# EAGLE design launchpad (EAGLE 6.3)
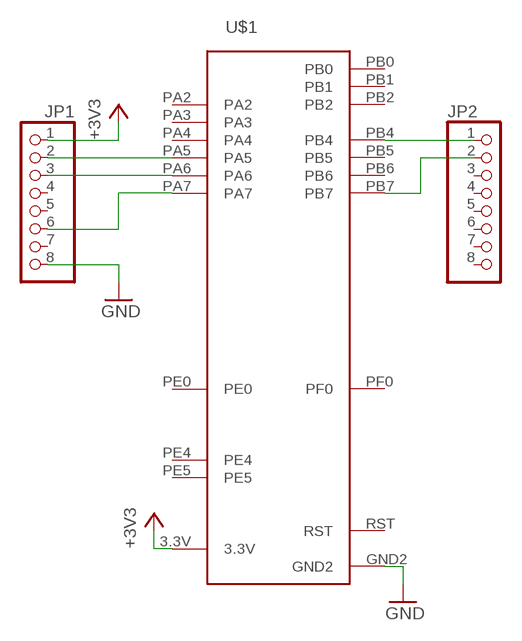
[diagram p0: schematic, sheet 1]

## Parts
JP1  PINHD-1X8  [1X08]
JP2  PINHD-1X8  [1X08]
U$1  STELLARIS-LAUNCHPAD-COMPATIBLESTELLARIS-LAUNCHPAD-COMPATIBLE  [LAUNCHPAD-COMPATIBLE]

## Nets
+3V3: JP1.1 U$1.3.3V
GND: JP1.8 U$1.GND2
N$1: JP2.2 U$1.PB7
N$2: JP2.1 U$1.PB4
N$3: JP1.2 U$1.PA5
N$4: JP1.3 U$1.PA6
N$5: JP1.6 U$1.PA7
Unconnected: JP1.4 JP1.5 JP1.7 JP2.3 JP2.4 JP2.5 JP2.6 JP2.7 JP2.8 U$1.PA2 U$1.PA3 U$1.PA4 U$1.PB0 U$1.PB1 U$1.PB2 U$1.PB5 U$1.PB6 U$1.PE0 U$1.PE4 U$1.PE5 U$1.PF0

## Power pins joined to a net without a drawn wire
RST: U$1.RST

## Library data of the parts
JP1 JP2 = pinhead:PINHD-1X8: PIN HEADER
U$1 = StellarisLaunchPad_Fred:STELLARIS-LAUNCHPAD-COMPATIBLE

## Board
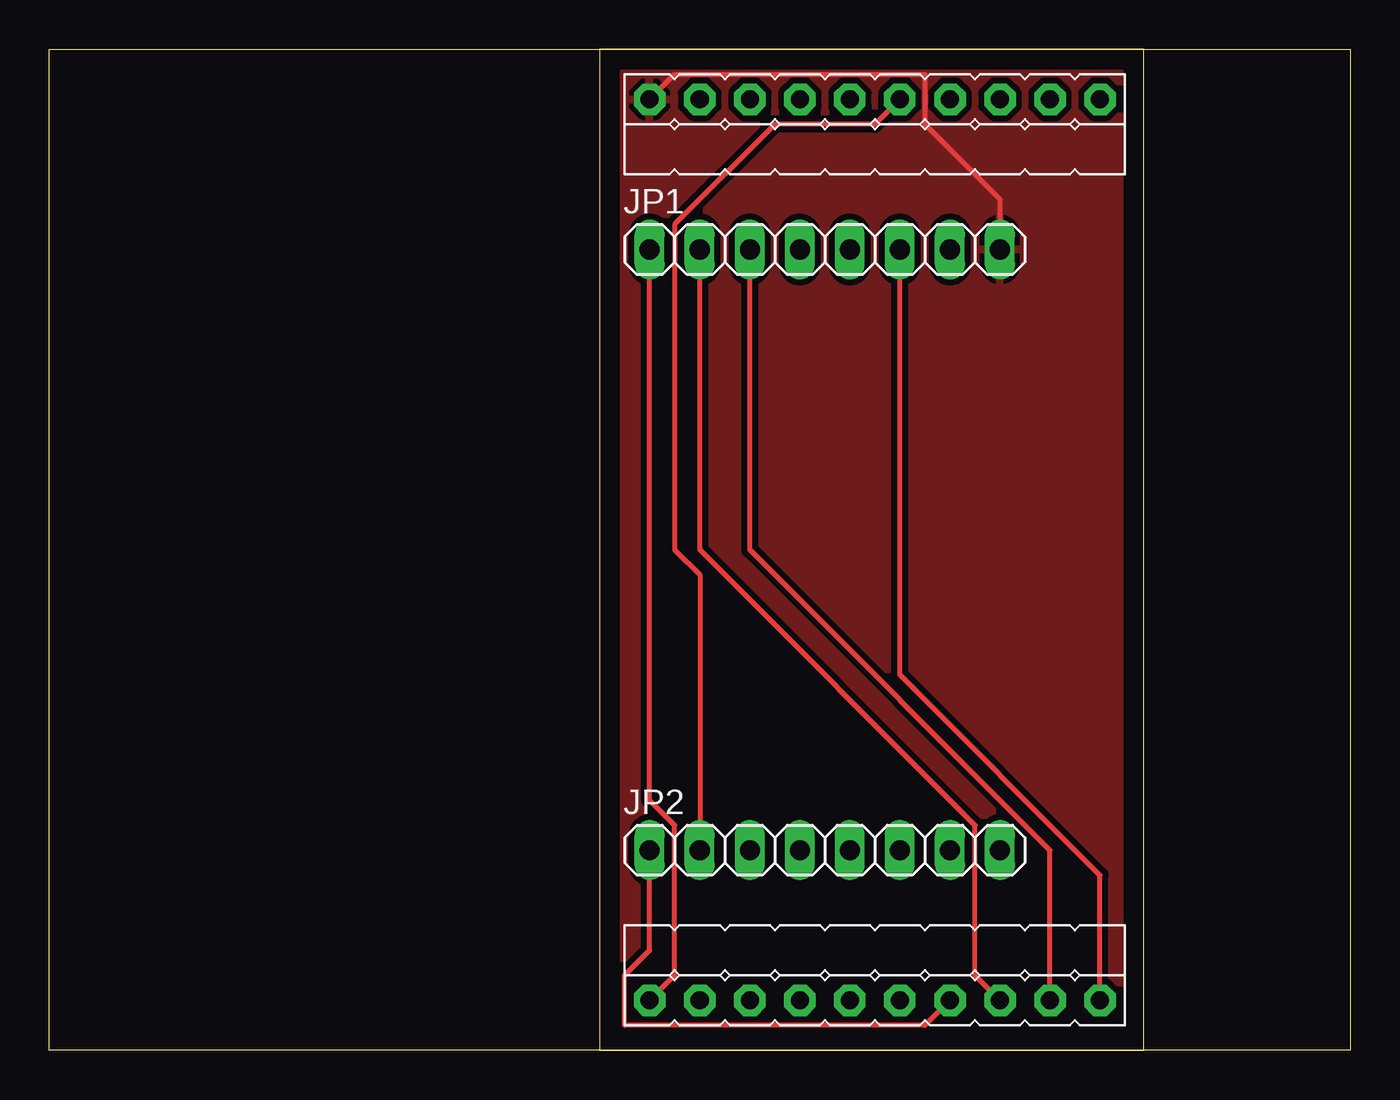
[diagram p1: board, top side]

Size 27.61 x 50.79 mm. Coordinates in mm from the lower left corner, seen from the top.
Outline: 0,0 27.61,0 27.61,50.79 0,50.79 0,0
Copper layers (1*16): Top 0.035mm / dielectric 1.5mm / Bottom 0.035mm
Design rules "default *": minimum track width 10mil, minimum drill 24mil, track to track 12mil, track to pad 12mil, pad to pad 12mil, via to via 12mil, smd to smd 12mil, copper to edge 40mil, drill to drill 8mil, minimum pad ring 10mil, minimum via ring 8mil, stop-mask expansion 4mil, vias tented up to drill 0mil, thermal gap 10mil

### Footprints (pad centres in the part's own frame; a part is rotated, then mirrored left to right if it is on the bottom)
1X08 = drill 1.016 long: 1 -8.89,0; 2 -6.35,0; 3 -3.81,0; 4 -1.27,0; 5 1.27,0; 6 3.81,0; 7 6.35,0; 8 8.89,0
LAUNCHPAD-COMPATIBLE = drill 0.914 pad 1.6 octagon: 3.3V 30.48,2.54; GND2 30.48,48.26; PA2 53.34,48.26; PA3 50.8,48.26; PA4 48.26,48.26; PA5 48.26,2.54; PA6 50.8,2.54; PA7 53.34,2.54; PB0 35.56,2.54; PB1 38.1,2.54; PB2 33.02,48.26; PB4 45.72,2.54; PB5 33.02,2.54; PB6 45.72,48.26; PB7 43.18,48.26; PE0 35.56,48.26; PE4 40.64,2.54; PE5 43.18,2.54; PF0 38.1,48.26; RST 40.64,48.26

### Placement (x,y rotation side)
JP1  11.43,40.64 0 top
JP2  11.43,10.16 0 top
U$1  -27.94,0 0 top

### Tracks (layer width: path | path; a pad name or v marks a point on that pad's centre or on a via)
+3V3
  Top 0.254: JP1.1 2.54,12.7 3.81,11.43 3.81,3.81 U$1.3.3V
GND
  Top 0.254: JP1.8 20.32,43.18 16.51,46.99 16.51,49.53 3.81,49.53 U$1.GND2
  pour Top: 0,50.8 0,0 27.94,0 27.94,50.8
N$1
  Top 0.254: JP2.2 5.08,24.13 3.81,25.4 3.81,41.91 8.89,46.99 13.97,46.99 U$1.PB7
N$2
  Top 0.254: JP2.1 2.54,5.08 1.27,3.81 1.27,1.27 16.51,1.27 U$1.PB4
N$3
  Top 0.254: JP1.2 5.08,25.4 19.05,11.43 19.05,3.81 U$1.PA5
N$4
  Top 0.254: JP1.3 7.62,25.4 22.86,10.16 U$1.PA6
N$5
  Top 0.254: JP1.6 15.24,19.05 25.4,8.89 U$1.PA7